# EAGLE design search_controller (EAGLE 9.5.1)
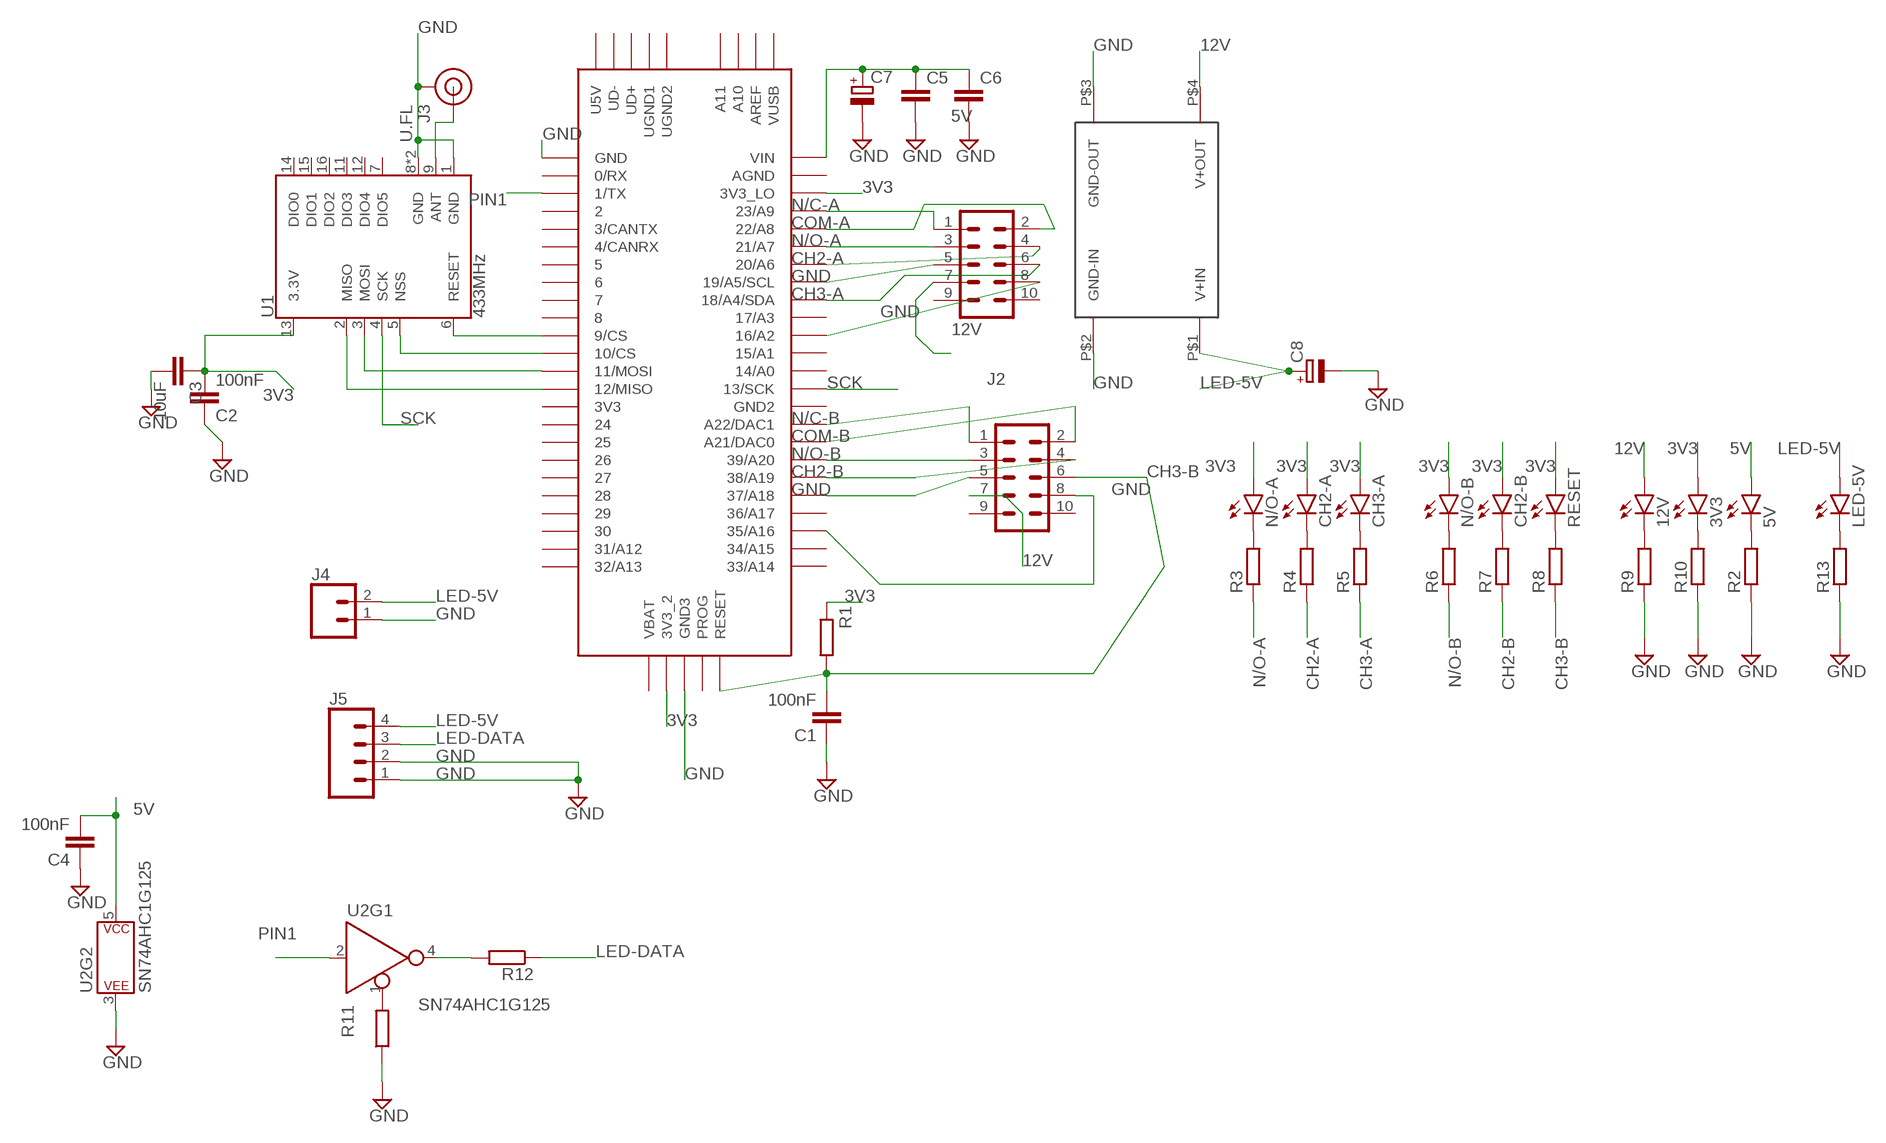
[diagram p0: schematic, sheet 1]

## Parts
3V3  LEDCHIPLED_0805  [CHIPLED_0805]
5V  LEDCHIPLED_0805  [CHIPLED_0805]
12V  LEDCHIPLED_0805  [CHIPLED_0805]
C1  100nF  C-EUC0805  [C0805]
C2  100nF  C-EUC0805  [C0805]
C3  10uF  C-EUC0805  [C0805]
C4  100nF  C-EUC0805  [C0805]
C5  C-EUC0805K  [C0805K]
C6  C-EUC0805K  [C0805K]
C7  CPOL-EUE2,5-6E  [E2,5-6E]
C8  CPOL-EUE5-8.5  [E5-8,5]
CH2-A  LEDCHIPLED_0805  [CHIPLED_0805]
CH2-B  LEDCHIPLED_0805  [CHIPLED_0805]
CH3-A  LEDCHIPLED_0805  [CHIPLED_0805]
J1  CONN_05X2PTH  [2X5]
J2  CONN_05X2PTH  [2X5]
J3  U.FL  U.FL2PIN  [U.FL]
J4  CONN_023.5MM-NO_SILK  [SCREWTERMINAL-3.5MM-2-NS]
J5  CONN_04  [1X04]
LED-5V  LEDCHIPLED_0805  [CHIPLED_0805]
N/O-A  LEDCHIPLED_0805  [CHIPLED_0805]
N/O-B  LEDCHIPLED_0805  [CHIPLED_0805]
R1  R-EU_M0805  [M0805]
R2  R-EU_R0603  [R0603]
R3  R-EU_R0603  [R0603]
R4  R-EU_R0603  [R0603]
R5  R-EU_R0603  [R0603]
R6  R-EU_R0603  [R0603]
R7  R-EU_R0603  [R0603]
R8  R-EU_R0603  [R0603]
R9  R-EU_R0603  [R0603]
R10  R-EU_R0603  [R0603]
R11  R-EU_R0603  [R0603]
R12  R-EU_R0603  [R0603]
R13  R-EU_R0603  [R0603]
RESET  LEDCHIPLED_0805  [CHIPLED_0805]
U1  433MHz  RFM69HCW-433  [RFM69HCW-XXXS2]
U2  SN74AHC1G125  74AHC1G125D  [SOT23-5]
U$1  TEENSY_3.5/3.6  [TEENSY_3.5/3.6]
U$2  BUCK/BOOST  [STANDARDBUCKBOOST]

## Nets
3V3: 3V3.A C2.2 C3.1 CH2-A.A CH2-B.A CH3-A.A N/O-A.A N/O-B.A R1.2 RESET.A U1.13(3.3V) U$1.3V3_2 U$1.3V3_LO
5V: 5V.A C4.2 C5.1 C6.1 C7.+ U2.5(P$V+) U$1.VIN
12V: 12V.A J1.7 J2.7 U$2.P$4(V+OUT)
CH2-A: J1.4 R4.1 U$1.20/A6
CH2-B: J2.4 R7.1 U$1.38/A19
CH3-A: J1.6 R5.1 U$1.18/A4/SDA
CH3-B: C1.2 J2.6 R1.1 R8.1 U$1.RESET
COM-A: J1.2 U$1.22/A8
COM-B: J2.2 U$1.21/DAC0(A21/DAC0)
GND: C1.1 C2.1 C3.2 C4.1 C5.2 C6.2 C7.- C8.- J1.5 J1.8 J2.5 J2.8 J3.1(GND) J3.2(GND) J4.1 J5.1 J5.2 R2.1 R9.1 R10.1 R11.1 R13.1 U1.1(GND) U1.8(GND) U1.10(GND) U2.3(P$V-) U$1.16/A2 U$1.19/A5/SCL U$1.35/A16 U$1.37/A18 U$1.GND U$1.GND3 U$2.P$2(GND-IN) U$2.P$3(GND-OUT)
LED-5V: C8.+ J4.2 J5.4 LED-5V.A U$2.P$1(V+IN)
LED-DATA: J5.3 R12.1
N$1: U1.2(MISO) U$1.12/MISO
N$2: U1.3(MOSI) U$1.11/MOSI
N$3: U1.5(NSS) U$1.10/CS
N$4: J3.FEED(SIGNAL) U1.9(ANT)
N$5: U1.6(RESET) U$1.9/CS
N$6: N/O-A.C R3.2
N$8: CH2-A.C R4.2
N$9: CH3-A.C R5.2
N$10: N/O-B.C R6.2
N$11: CH2-B.C R7.2
N$12: R8.2 RESET.C
N$13: 12V.C R9.2
N$14: 3V3.C R10.2
N$15: R12.2 U2.4(Y)
N$16: LED-5V.C R13.2
N$21: 5V.C R2.2
N$22: R11.2 U2.1(!EN)
N/C-A: J1.1 U$1.23/A9
N/C-B: J2.1 U$1.A22/DAC1
N/O-A: J1.3 R3.1 U$1.21/A7
N/O-B: J2.3 R6.1 U$1.39/A20
PIN1: U2.2(A) U$1.1/TX
SCK: U1.4(SCK) U$1.13/SCK
Unconnected: J1.9 J1.10 J2.9 J2.10 U1.7(DIO5) U1.11(DIO3) U1.12(DIO4) U1.14(DIO0) U1.15(DIO1) U1.16(DIO2) U$1.0/RX U$1.2 U$1.3/CANTX U$1.3V3 U$1.4/CANRX U$1.5 U$1.6 U$1.7 U$1.8 U$1.14/A0 U$1.15/A1 U$1.17/A3 U$1.24 U$1.25 U$1.26 U$1.27 U$1.28 U$1.29 U$1.30 U$1.31/A12 U$1.32/A13 U$1.33/A14 U$1.34/A15 U$1.36/A17 U$1.A10 U$1.A11 U$1.AGND U$1.AREF U$1.GND2 U$1.PROG U$1.U5V U$1.UD+ U$1.UD- U$1.UGND1 U$1.UGND2 U$1.VBAT U$1.VUSB

## Library data of the parts
3V3 5V 12V CH2-A CH2-B CH3-A LED-5V N/O-A N/O-B RESET = led:LED: LED OSRAM: - CHIPLED LG R971, LG N971, LY N971, LG Q971, LY Q971, LO R971, LY R971 LH N974, LH R974 LS Q976, LO Q976, LY Q976 LO Q996 - Hyper CHIPLED LW Q18S LB Q993, LB Q99A, LB R99A - SideLED LS A670, LO A670, LY A670, LG A670, LP A670 LB A673, LV A673, LT A673, LW A673 LH A674 LY A675 LS A676, LA A676, LO A676, LY A676, LW A676 LS A679, LY A679, LG A679 - Hyper Micro SIDELED® LS Y876, LA Y876, LO Y876, LY Y876 LT Y87S - SmartLED LW L88C, LW L88S LB L89C, LB L89S, LG L890 LS L89K, LO L89K, LY L89K LS L896, LA L896, LO L896, LY L896 - TOPLED LS T670, LO T670, LY T670, LG T670, LP T670 LSG T670, LSP T670, LSY T670, LOP T670, LYG T670 LG T671, LOG T671, LSG T671 LB T673, LV T673, LT T673, LW T673 LH T674 LS T676, LA T676, LO T676, LY T676, LB T676, LH T676, LSB T676, LW T676 LB T67C, LV T67C, LT T67C, LS T67K, LO T67K, LY T67K, LW E67C LS E67B, LA E67B, LO E67B, LY E67B, LB E67C, LV E67C, LT E67C LW T67C LS T679, LY T679, LG T679 LS T770, LO T770, LY T770, LG T770, LP T770 LB T773, LV T773, LT T773, LW T773 LH T774 LS E675, LA E675, LY E675, LS T675 LS T776, LA T776, LO T776, LY T776, LB T776 LHGB T686 LT T68C, LB T68C - Hyper Mini TOPLED® LB M676 - Mini TOPLED Santana® LG M470 LS M47K, LO M47K, LY M47K Source: http://www.osram.convergy.de LUXEON: - LUMILED® LXK2-PW12-R00, LXK2-PW12-S00, LXK2-PW14-U00, LXK2-PW14-V00 LXK2-PM12-R00, LXK2-PM12-S00, LXK2-PM14-U00 LXK2-PE12-Q00, LXK2-PE12-R00, LXK2-PE12-S00, LXK2-PE14-T00, LXK2-PE14-U00 LXK2-PB12-K00, LXK2-PB12-L00, LXK2-PB12-M00, LXK2-PB14-N00, LXK2-PB14-P00, LXK2-PB14-Q00 LXK2-PR12-L00, LXK2-PR12-M00, LXK2-PR14-Q00, LXK2-PR14-R00 LXK2-PD12-Q00, LXK2-PD12-R00, LXK2-PD12-S00 LXK2-PH12-R00, LXK2-PH12-S00 LXK2-PL12-P00, LXK2-PL12-Q00, LXK2-PL12-R00 Source: www.luxeon.com KINGBRIGHT: KA-3528ASYC Source: www.kingbright.com
C1-C6 = rcl:C-EU: CAPACITOR, European symbol; SPICEPREFIX: C
C7 C8 = rcl:CPOL-EU: POLARIZED CAPACITOR, European symbol; SPICEPREFIX: C
J1 J2 = SparkFun-Connectors:CONN_05X2: Multi connection point. Often used as Generic Header-pin footprint for 0.1 inch spaced/style header connections For AVR SPI programming port, see special device with nice symbol: "AVR_SPI_PROG_5x2.dev" You can populate with any combo of single row headers, but if you'd like an exact match, check these: 2x5 AVR ICSP Male Header <https://www.sparkfun.com/products/778> (PRT-00778) 2x5 Pin Shrouded Header <https://www.sparkfun.com/products/8506> (PRT-08506) On any of the 0.1 inch spaced packages, you can populate with these: Break Away Headers - Straight <https://www.sparkfun.com/products/116> (PRT-00116) Break Away Male Headers - Right Angle <https://www.sparkfun.com/products/553> (PRT-00553) Female Headers <https://www.sparkfun.com/products/115> (PRT-00115) Break Away Headers - Machine Pin <https://www.sparkfun.com/products/117> (PRT-00117) Break Away Female Headers - Swiss Machine Pin <https://www.sparkfun.com/products/743> (PRT-00743) Special note: the shrouded connector mates well with our 5x2 ribbon cables: 2x5 Pin IDC Ribbon Cable <https://www.sparkfun.com/products/8535> (PRT-08535); PROD_ID: CONN-08499; SF_ID: PRT-0778
J3 = SparkFun-Connectors:U.FL2PIN: SMD Antenna Connector - U.FL 2mm height, 3.0mm x 3.0mm receptacle size. SparkFun Products: SparkFun WiFi Shield - ESP8266 <https://www.sparkfun.com/products/13287> SparkFun ESP8266 Thing <https://www.sparkfun.com/products/13231> SparkFun MiniGen - Pro Mini Signal Generator Shield <https://www.sparkfun.com/products/11420>; PROD_ID: CONN-09193; SF_ID: WRL-09144
J4 = SparkFun-Connectors:CONN_02: Multi connection point. Often used as Generic Header-pin footprint for 0.1 inch spaced/style header connections On any of the 0.1 inch spaced packages, you can populate with these: Break Away Headers - Straight <https://www.sparkfun.com/products/116> (PRT-00116) Break Away Male Headers - Right Angle <https://www.sparkfun.com/products/553> (PRT-00553) Female Headers <https://www.sparkfun.com/products/115> (PRT-00115) Break Away Headers - Machine Pin <https://www.sparkfun.com/products/117> (PRT-00117) Break Away Female Headers - Swiss Machine Pin <https://www.sparkfun.com/products/743> (PRT-00743) For SCREWTERMINALS and SPRING TERMINALS visit here: Screw Terimnals on SparkFun.com <https://www.sparkfun.com/search/results?term=Screw+Terminals> (5mm/3.5mm/2.54mm spacing) This device is also useful as a general connection point to wire up your design to another part of your project. Our various solder wires solder well into these plated through hole pads. Hook-Up Wire - Assortment (Stranded, 22 AWG) <https://www.sparkfun.com/products/11375> (PRT-11375) Hook-Up Wire - Assortment (Solid Core, 22 AWG) <https://www.sparkfun.com/products/11367> (PRT-11367) View the entire wire category on our website here <https://www.sparkfun.com/categories/141> Special notes: Molex polarized connector foot print use with: PRT-08233 with associated crimp pins and housings. 2.54_SCREWTERM for use with PRT-10571. 3.5mm Screw Terminal footprints for PRT-08084 5mm Screw Terminal footprints for use with PRT-08432; PROD_ID: CONN-08399
J5 = SparkFun-Connectors:CONN_04: Multi connection point. Often used as Generic Header-pin footprint for 0.1 inch spaced/style header connections On any of the 0.1 inch spaced packages, you can populate with these: Break Away Headers - Straight <https://www.sparkfun.com/products/116> (PRT-00116) Break Away Male Headers - Right Angle <https://www.sparkfun.com/products/553> (PRT-00553) Female Headers <https://www.sparkfun.com/products/115> (PRT-00115) Break Away Headers - Machine Pin <https://www.sparkfun.com/products/117> (PRT-00117) Break Away Female Headers - Swiss Machine Pin <https://www.sparkfun.com/products/743> (PRT-00743) For SCREWTERMINALS and SPRING TERMINALS visit here: Screw Terimnals on SparkFun.com <https://www.sparkfun.com/search/results?term=Screw+Terminals> (5mm/3.5mm/2.54mm spacing) This device is also useful as a general connection point to wire up your design to another part of your project. Our various solder wires solder well into these plated through hole pads. Hook-Up Wire - Assortment (Stranded, 22 AWG) <https://www.sparkfun.com/products/11375> (PRT-11375) Hook-Up Wire - Assortment (Solid Core, 22 AWG) <https://www.sparkfun.com/products/11367> (PRT-11367) View the entire wire category on our website here <https://www.sparkfun.com/categories/141> Special notes: Molex polarized connector foot print use with SKU : PRT-08231 with associated crimp pins and housings. 1MM SMD Version SKU: PRT-10208; PROD_ID: CONN-09696
R1-R13 = rcl:R-EU_: RESISTOR, European symbol; SPICEPREFIX: R
U1 = SparkFun-RF:RFM69H: Hope RF RFM69H ISM Transceiver Module The RFM69H is a transceiver module capable of operation over a wide frequency range, including the 315,433,868 and 915MHz license-free ISM (Industry Scientific and Medical) frequency bands. All major RF communication parameters are programmable and most of them can be dynamically set. The RFM69H offers the unique advantage of programmable narrow-band and wide- band communication modes. The RFM69H is optimized for low power consumption while offering high RF output power and channelized operation.Compliance ETSI and FCC regulations. Datasheet <http://www.hoperf.cn/upload/docs/RF/SX/RFM69H_DataSheet_v1.3.pdf> SparkFun Products RFM69HCW Wireless Transceiver - 915MHz <https://www.sparkfun.com/products/13909> (COM-13909) RFM69HCW Wireless Transceiver - 434MHz <https://www.sparkfun.com/products/13910> (COM-13910) SparkFun RFM69 Breakout (915MHz) <https://www.sparkfun.com/products/12775> (WRL-12775) SparkFun RFM69 Breakout (434MHz) <https://www.sparkfun.com/products/12823> (WRL-12823); PROD_ID: IC-12053
U2 = SparkFun-IC-Logic:74*1G125: Single buffer Buffers & Line Drivers Tri-State Single Bus SOT-23-5 Datasheet SparkFun Products SparkFun SAMD21 Mini Breakout <https://www.sparkfun.com/products/13664> (DEV-13664) SparkFun SAMD21 Dev Breakout <https://www.sparkfun.com/products/13672> (DEV-13672) SparkFun MIDI Shield <https://www.sparkfun.com/products/12898> (DEV-12898) SparkFun WiFi Shield - CC3000 <https://www.sparkfun.com/products/12071> (DEV-12071); PROD_ID: IC-11920
U$1 = Teensy356:TEENSY_3.5/3.6
U$2 = paul_power:BUCK/BOOST

## Board
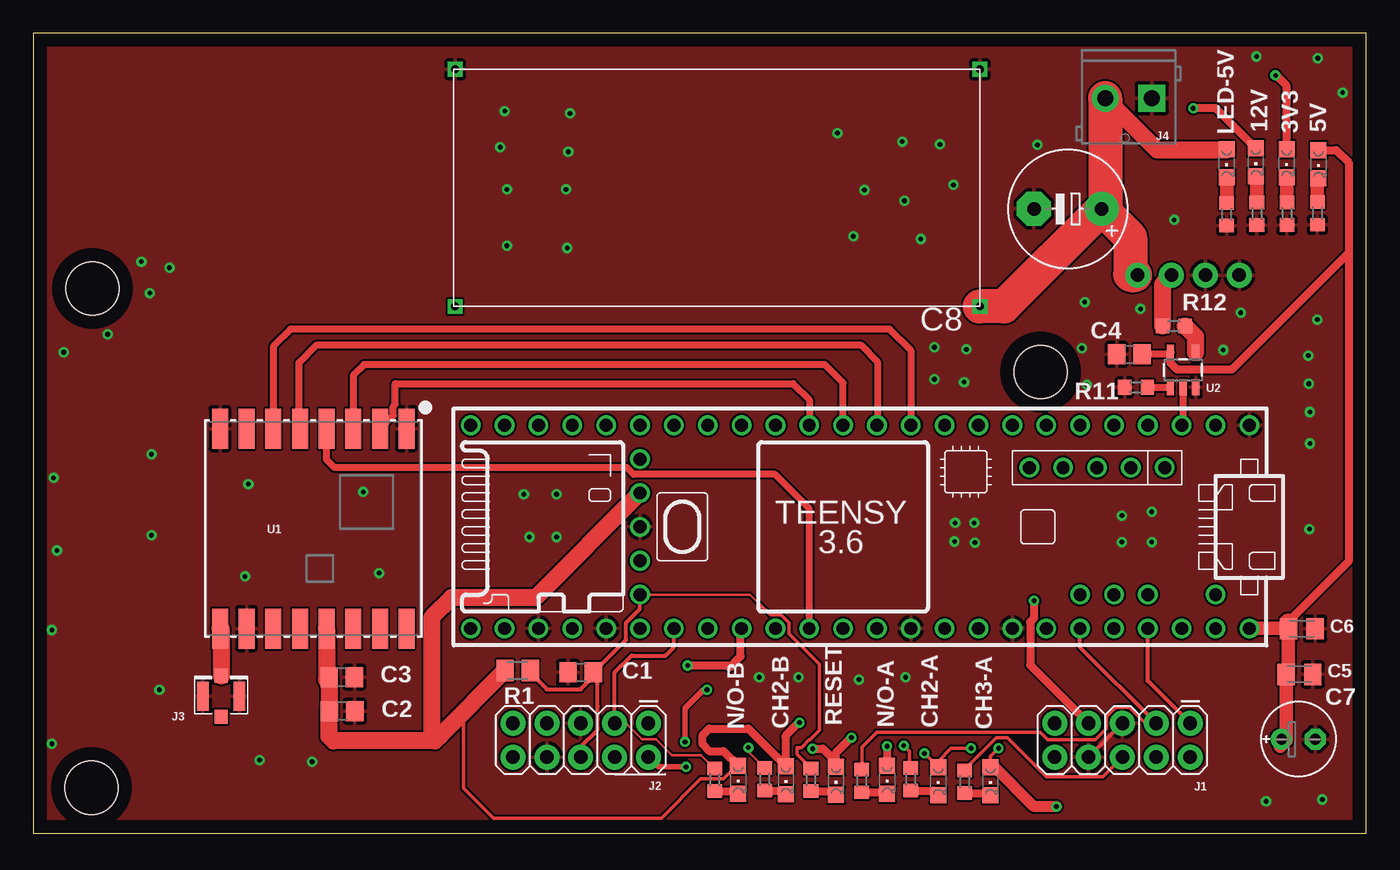
[diagram p1: board, top side]
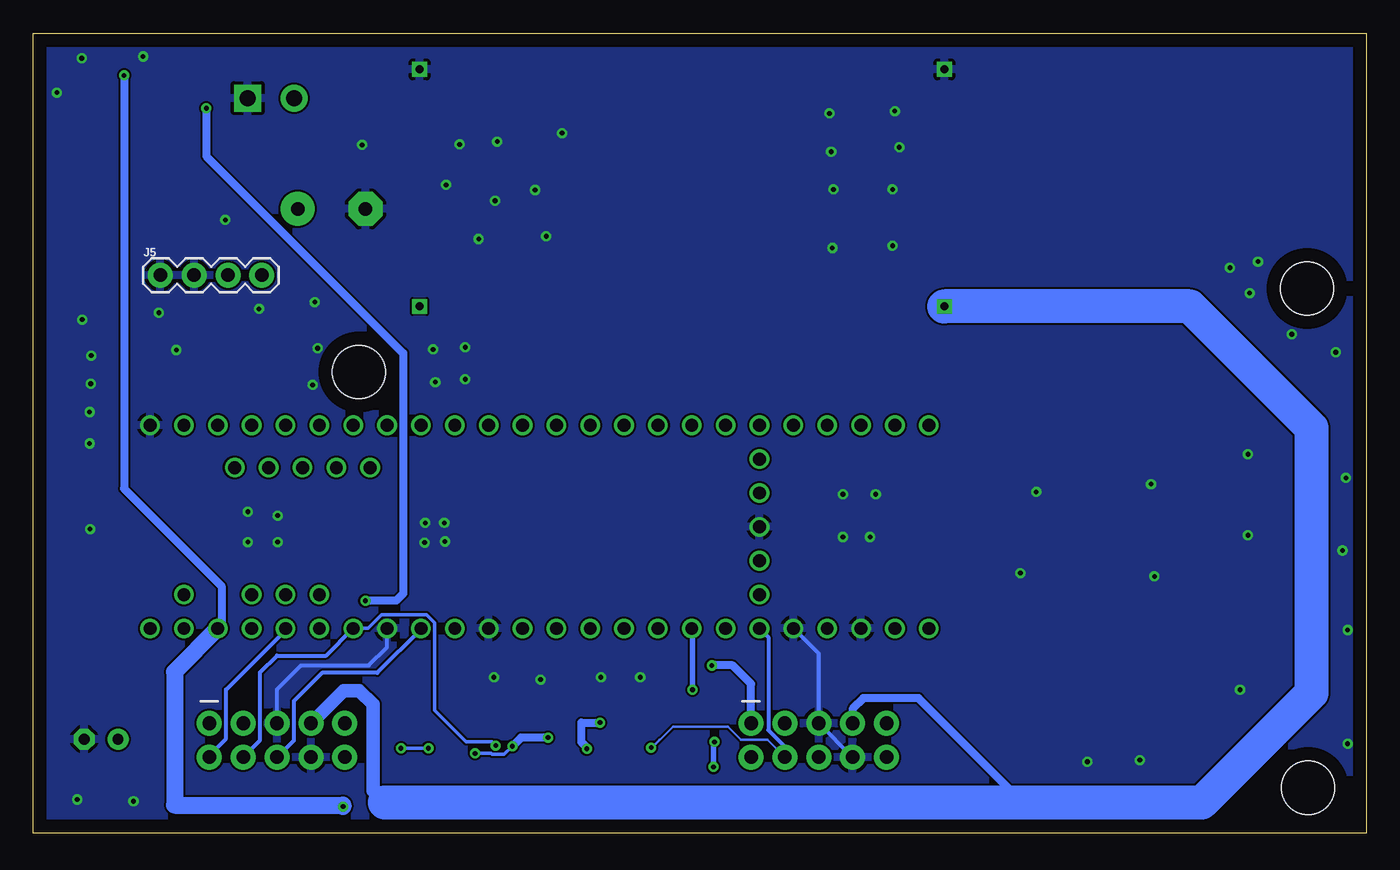
[diagram p2: board, bottom side, seen from below]

Size 100 x 60 mm. Coordinates in mm from the lower left corner, seen from the top.
Outline: 0,0 100,0 100,60 0,60 0,0
Copper layers (1*16): Top 0.035mm / dielectric 1.5mm / Bottom 0.035mm
Design rules "default": minimum track width 6mil, minimum drill 0.35mm, track to track 6mil, track to pad 6mil, pad to pad 6mil, via to via 6mil, smd to smd 6mil, copper to edge 40mil, drill to drill 6mil, minimum pad ring 10mil, minimum via ring 8mil, stop-mask expansion 4mil, vias tented up to drill 0mil, thermal gap 10mil
Holes 4 mm at 4.44,40.86 75.59,34.6 4.35,3.42

### Footprints (pad centres in the part's own frame; a part is rotated, then mirrored left to right if it is on the bottom)
CHIPLED_0805 = smd 1.2 x 1.2: A 0,-1.05; C 0,1.05
C0805 = smd 1.3 x 1.5: 1 -0.95,0; 2 0.95,0
C0805K = smd 1.3 x 1.6: 1 -1,0; 2 1,0
E2,5-6E = drill 0.813 pad 1.575: + -1.27,0 | drill 0.813 pad 1.575 octagon: - 1.27,0
E5-8,5 = drill 1.016 pad 2.54: + -2.54,0 | drill 1.016 pad 2.54 octagon: - 2.54,0
2X5 = drill 1.016 pad 1.88: 1 0,0; 2 0,2.54; 3 2.54,0; 4 2.54,2.54; 5 5.08,0; 6 5.08,2.54; 7 7.62,0; 8 7.62,2.54; 9 10.16,0; 10 10.16,2.54
U.FL = smd 2.2 x 0.85: 1 0,1.375; 2 0,-1.375 | smd 1.05 x 1: FEED 1.525,0; NC -1.525,0
SCREWTERMINAL-3.5MM-2-NS = drill 1.2 pad 2.032 square: 1 0,0 | drill 1.2 pad 2.032: 2 3.5,0
1X04 = drill 1.016 pad 1.88: 1 0,0; 2 2.54,0; 3 5.08,0; 4 7.62,0
M0805 = smd 1.3 x 1.6: 1 -0.95,0; 2 0.95,0
R0603 = smd 1 x 1.1: 1 -0.85,0; 2 0.85,0
RFM69HCW-XXXS2 = smd 3 x 1.2: 1 -7.5,7; 2 -7.5,5; 3 -7.5,3; 4 -7.5,1; 5 -7.5,-1; 6 -7.5,-3; 7 -7.5,-5; 8 -7.5,-7; 9 7.5,-7; 10 7.5,-5; 11 7.5,-3; 12 7.5,-1; 13 7.5,1; 14 7.5,3; 15 7.5,5; 16 7.5,7
SOT23-5 = smd 0.55 x 1.2: 1 -0.95,-1.3; 2 0,-1.3; 3 0.95,-1.3; 4 0.95,1.3; 5 -0.95,1.3
TEENSY_3.5/3.6 = drill 0.965: 0/RX -25.4,-7.62; 1/TX -22.86,-7.62; 2 -20.32,-7.62; 3/CANTX -17.78,-7.62; 3V3 7.62,-7.62; 3V3_2 17.78,-2.54; 3V3_LO -22.86,7.62; 4/CANRX -15.24,-7.62; 5 -12.7,-7.62; 6 -10.16,-7.62; 7 -7.62,-7.62; 8 -5.08,-7.62; 9/CS -2.54,-7.62; 10/CS 0,-7.62; 11/MOSI 2.54,-7.62; 12/MISO 5.08,-7.62; 13/SCK 5.08,7.62; 14/A0 2.54,7.62; 15/A1 0,7.62; 16/A2 -2.54,7.62; 17/A3 -5.08,7.62; 18/A4/SDA -7.62,7.62; 19/A5/SCL -10.16,7.62; 20/A6 -12.7,7.62; 21/A7 -15.24,7.62; 21/DAC0 12.7,7.62; 22/A8 -17.78,7.62; 23/A9 -20.32,7.62; 24 10.16,-7.62; 25 12.7,-7.62; 26 15.24,-7.62; 27 17.78,-7.62; 28 20.32,-7.62; 29 22.86,-7.62; 30 25.4,-7.62; 31/A12 27.94,-7.62; 32/A13 30.48,-7.62; 33/A14 30.48,7.62; 34/A15 27.94,7.62; 35/A16 25.4,7.62; 36/A17 22.86,7.62; 37/A18 20.32,7.62; 38/A19 17.78,7.62; 39/A20 15.24,7.62; A10 -17.78,5.08; A11 -15.24,5.08; A22/DAC1 10.16,7.62; AGND -25.4,7.62; AREF -20.32,5.08; GND -27.94,-7.62; GND2 7.62,7.62; GND3 17.78,0; PROG 17.78,2.54; RESET 17.78,5.08; U5V -21.59,-4.445; UD+ -16.51,-4.445; UD- -19.05,-4.445; UGND1 -13.97,-4.445; UGND2 -11.43,-4.445; VBAT 17.78,-5.08; VIN -27.94,7.62; VUSB -25.4,5.08
STANDARDBUCKBOOST = drill 0.6 square: P$1 -10.16,-20.32; P$2 7.62,-20.32; P$3 7.62,19.05; P$4 -10.16,19.05

### Placement (x,y rotation side)
3V3  94.03,50.27 180 top
5V  96.42,50.19 180 top
12V  91.72,50.32 180 top
C1  41.07,12.06 0 top
C2  23.16,9.17 180 top
C3  23.14,11.71 0 top
C4  82.23,35.92 0 top
C5  95,11.91 0 top
C6  95.17,15.34 0 top
C7  94.92,7.06 0 top
C8  77.62,46.84 180 top
CH2-A  67.89,3.91 180 top
CH2-B  56.46,3.99 180 top
CH3-A  71.81,3.91 180 top
J1  86.79,8.26 180 top
J2  46.15,8.26 180 top
J3  14.1,10.29 90 top
J4  83.92,55.14 180 top
J5  90.47,41.86 0 bottom
LED-5V  89.53,50.24 180 top
N/O-A  64.06,4.01 180 top
N/O-B  52.88,4.01 180 top
R1  36.35,12.22 180 top
R2  96.34,46.5 90 top
R3  62.15,3.94 270 top
R4  65.84,4.05 270 top
R5  69.88,3.87 270 top
R6  51.13,4.03 270 top
R7  54.86,4.05 270 top
R8  58.34,4.03 270 top
R9  91.8,46.47 90 top
R10  94.06,46.47 90 top
R11  82.73,33.45 0 top
R12  85.57,38.05 0 top
R13  89.53,46.43 90 top
RESET  60.22,3.94 180 top
U1  21.01,22.86 270 top
U2  86.26,34.75 0 top
U$1  63.3,22.99 180 top
U$2  50.7,49.68 90 top

### Tracks (layer width: path | path; a pad name or v marks a point on that pad's centre or on a via)
3V3  (via drill 0.35)
  Top 0.254: R1.2 32.28,9.1 32.28,3.38 34.52,1.14 47.12,1.14 50.07,4.1 51.8,4.1 52.63,4.93 53.02,4.93 | v70.36,6.38 68.85,6.38 67.89,5.42 CH2-A.A 66.86,5.99 v66.85,5.99 | v72.42,6.38 72.39,6.38 71.81,5.79 CH3-A.A
  Top 0.61: 3V3.A 94.03,56.06 93.24,56.84 v93.19,56.84 | RESET.A 60.22,5.36 | 60.22,5.36 60.22,6.04 61.37,7.19 v61.38,7.18 | v64.06,6.53 N/O-A.A | v57.48,8.31 57.45,8.33 56.44,7.32 56.44,7.16 56.46,7.14 CH2-B.A 53.66,7.85 50.71,7.85 50.22,7.36 50.22,6.66 50.71,6.17 51.78,6.17 N/O-B.A | v58.47,6.35 59.23,6.35 60.22,5.36 | N/O-B.A | N/O-B.A 53.02,4.93
  Top 0.813: v76.76,2.01 75.08,2.01 72.13,4.96 CH3-A.A
  Top 1.27: U1.13 22.01,11.53 C3.1 22.19,9.2 | 22.19,9.2 C2.2 | R1.2 30.58,7.4 | 30.58,7.4 30.11,6.93 22.53,6.93 22.19,7.28 22.19,9.2 | U$1.3V3_2 37.67,17.68 31.37,17.68 29.9,16.2 29.9,7.54 30.04,7.4 30.58,7.4
  Bottom 0.254: v72.42,6.38 v70.36,6.38 | v66.85,5.99 65.65,5.99 65.58,5.92 64.67,5.92 v64.06,6.53
  Bottom 0.61: v93.19,56.84 93.19,25.86 85.88,18.54 85.88,15.65 U$1.3V3_LO | v61.38,7.18 63.41,7.18 v64.06,6.53 | v58.47,6.35 58.47,6.43 58.9,6.86 58.9,8.28 58.88,8.31 v57.48,8.31
  Bottom 1.27: U$1.3V3_LO 89.41,12.12 89.41,2.11 76.76,2.11 v76.76,2.01
5V
  Top 0.508: U2.5 85.19,35.92 C4.2
  Top 0.61: 5V.A 97.76,51.24 98.68,50.32 98.68,43.54 | 98.68,43.54 98.68,20.4 94.15,15.87 | 98.68,43.54 89.92,34.77 85.83,34.77 85.31,35.29 U2.5
  Top 1.016: U$1.VIN 94.15,15.37 C6.1 94.17,12.09 C5.1 94,6.98 93.55,6.53 93.55,6.96 C7.+
  Top 1.27: 94.15,15.87 94.15,15.37
12V  (via drill 0.35)
  Top 0.61: 12V.A 88.7,54.38 v87.02,54.38 | v75.08,17.45 75.08,16.14 74.8,15.86 74.8,12.62 J1.7
  Bottom 0.61: v87.02,54.38 87.02,50.8 72.24,36.02 72.24,17.98 72.77,17.45 v75.08,17.45 | 12.33,2.3 25.75,2.3 33.59,10.14 37.73,10.14 38.53,9.34 J2.7
  Bottom 1.016: 73.63,2.3 74.52,3.2 74.52,9.68 75.54,10.69 76.73,10.69 J1.7
  Bottom 2.54: 73.63,2.3 73.62,2.3 12.33,2.3 4.09,10.54 4.09,30.39 13.21,39.52 U$2.P$4
CH2-A  (via drill 0.35)
  Top 0.254: v65.3,6.58 65.73,6.15 65.73,5 R4.1
  Bottom 0.254: v65.3,6.58 65.6,6.87 67.53,6.87 69.9,9.25 69.9,15.79 70.5,16.38 73.88,16.38 74.89,15.37 U$1.20/A6
  Bottom 0.305: J1.4 82.98,6.99 82.98,12.06 81.71,13.34 78.03,13.34 U$1.20/A6
CH2-B  (via drill 0.35)
  Top 0.2: R7.1 53.65,6.12 v53.65,6.43
  Bottom 0.2: v53.65,6.43 53.03,7.04 53.65,6.35 51.99,8 47.88,8 46.91,7.04 44.93,7.04 J2.4
  Bottom 0.305: J2.4 43.61,6.5 44.86,7.74 44.86,14.71 U$1.38/A19
CH3-A
  Top 0.254: J1.6 80.26,4.26 76.02,4.26 73.09,7.18 72.26,7.18 69.88,4.8 R5.1
  Bottom 0.305: U$1.18/A4/SDA 70.92,15.32 74.19,12.04 78.34,12.04 80.47,9.91 80.47,6.96 J1.6
CH3-B
  Top 0.2: 54.46,17.22 53.77,17.91 U$1.RESET
  Top 0.254: 54.46,17.22 55.3,16.38 56.1,16.38 56.69,15.79 56.69,14.99 58.98,12.7 58.98,7.72 58.27,7.01 58.2,7.01 57.62,6.43 57.28,6.43 57.28,5.94 R8.1
  Top 0.305: J2.6 41.07,6.5 42.32,7.74 42.32,9.5 42.34,9.53 42.34,11.74 42.18,11.9 | 42.18,11.9 C1.2 44.48,14.52 44.48,15.8 45.52,16.84 U$1.RESET | R1.1 37.3,12.03 38.53,10.79 41.07,10.79 42.18,11.9
COM-A
  Bottom 0.305: J1.2 86.79,5.86 85.55,7.11 85.55,10.77 81.08,15.24 U$1.22/A8
COM-B  (via drill 0.35)
  Top 0.406: J2.2 46.89,4.98 v48.97,4.98 | v48.9,6.86 48.9,9.4 50.27,10.77 v50.55,10.77
  Bottom 0.406: v48.97,4.98 48.97,6.83 48.92,6.88 v48.9,6.86 | v50.55,10.77 50.55,15.32 U$1.21/DAC0
GND  (via drill 0.35)
  Top 0.305: J1.5 J1.8
  Bottom 0.305: J1.5 81.71,10.79 79.91,12.6 74.83,12.6 73.46,13.97 U$1.19/A5/SCL | U$1.37/A18 41.07,13.46 J2.5 J2.8
  other vias: 8.11,42.88 10.22,42.42 8.75,40.52 1.52,26.66 35.53,44.07 35.53,48.29 35.03,51.46 35.36,54.16 40.26,54 40.14,51.12 39.97,48.29 40.05,43.9 95.65,35.83 95.7,33.72 95.78,31.6 95.78,29.24 69.16,23.28 70.6,23.28 70.64,21.8 69.12,21.89 36.8,25.43 39.25,25.43 39.25,22.22 37.22,22.22 25.94,19.52 15.89,19.27 16.14,26.2 24.76,25.6 16.98,5.49 20.91,5.37 54.46,11.7 57.42,11.7 61.94,11.53 65.45,11.7 92.49,2.41 96.71,2.54 95.74,22.82 67.6,36.46 70.01,36.29 69.84,33.84 67.6,34.05 89.27,36.25 79.05,33.63 78.67,36.38 78.88,39.84 83.06,39.33 90.58,39.04 96.33,38.53 66.59,44.57 69.04,48.63 65.19,51.88 62.36,48.25 61.52,44.78 65.36,47.45 68.02,51.67 60.33,52.52 1.77,21.21 1.39,15.25 2.28,36.08 5.58,37.43 1.39,6.72 9.46,10.77 8.87,22.35 8.87,28.43 81.67,23.83 83.91,24.12 83.91,21.84 81.67,21.84 96.37,58.14 91.77,58.26 85.6,46.01 98.23,55.56 75.33,51.63
  pour Top: 100,60 100,0.15 0,0.15 0,59.99
  pour Bottom: 0,0 100,0 100,60 0,60
LED-5V
  Top 0.254: J5.4 82.36,41.86
  Top 1.27: J4.2 84.31,51.26 89.5,51.26 LED-5V.A
  Top 2.54: J4.2 80.42,47.1 C8.+ | C8.+ 72.84,39.52 U$2.P$1 | C8.+ 82.3,44.69 82.3,41.91 82.36,41.86 82.66,41.86
LED-DATA
  Top 1.27: J5.3 84.72,41.18 R12.1
N$1
  Top 0.508: U1.2 27,31.35 27,32.03 27.15,32.18 27.15,33.73 57,33.73 58.22,32.51 U$1.12/MISO
N$2
  Top 0.508: U$1.11/MOSI 60.76,33.78 59.38,35.15 24.82,35.15 24.01,34.34 U1.3
N$3
  Top 0.508: U$1.10/CS 63.32,30.63 63.32,35.38 62.08,36.63 21.26,36.63 19.94,35.31 19.94,30.43 U1.5
N$4
  Top 1.27: U1.9 14.1,15.27 J3.FEED
N$5
  Top 0.508: U$1.9/CS 65.84,36.22 64.24,37.82 19.3,37.82 18.01,36.52 U1.6
N$6
  Top 0.61: R3.2 63.94,3.09 N/O-A.C
N$8
  Top 0.61: R4.2 67.56,3.2 CH2-A.C
N$9
  Top 0.61: R5.2 71.64,3.02 CH3-A.C
N$10
  Top 0.61: R6.2 52.67,3.17 N/O-B.C
N$11
  Top 0.61: R7.2 56.2,3.2 CH2-B.C
N$12
  Top 0.61: R8.2 59.94,3.17 RESET.C
N$13
  Top 1.016: R9.2 91.8,49.19 12V.C
N$14
  Top 1.016: 3V3.C 94.06,49.19 R10.2
N$15
  Top 1.27: U2.4 87.21,37.26 R12.2
N$16
  Top 1.016: R13.2 LED-5V.C
N$21
  Top 1.016: 5V.C 96.34,49.06 R2.2
N$22
  Top 0.508: R11.2 U2.1
N/C-A
  Top 0.305: J1.1 83.62,11.43 U$1.23/A9
N/C-B  (via drill 0.35)
  Top 0.152: 53.06,15.29 U$1.A22/DAC1
  Top 0.61: v49.09,12.59 52.05,12.59 52.22,12.42 53.06,13.27 53.06,15.29
  Bottom 0.61: J2.1 46.15,11.21 47.53,12.59 v49.09,12.59
N/O-A
  Top 0.254: R3.1 62.15,6.46 63.28,7.59 75.57,7.59 76.13,7.04 79.68,7.04 80.49,7.85 80.49,8.76 81.21,9.47 82.22,9.47 83.44,8.26 J1.3
  Top 0.305: J1.3 78.54,13.97 U$1.21/A7
N/O-B
  Top 0.2: J2.3 44.47,8.26 45.66,7.06 46.73,7.06 47.93,5.87 50.09,5.87 51.26,4.7 51.26,4.85 51.13,4.98 51.13,4.95 50.95,4.95 50.93,4.98 51,4.98 51.03,4.95 51.03,4.88 51.21,4.7
  Top 0.305: J2.3 43.61,12.06 44.88,13.34 47.42,13.34 48.06,13.97 U$1.39/A20
  Top 0.406: R6.1 51.13,4.83 51.26,4.7
  Top 0.61: R6.1 51.13,4.78 51.21,4.7
PIN1
  Top 0.508: U2.2 86.26,30.71 U$1.1/TX
SCK
  Top 0.508: U$1.13/SCK 58.22,24.33 55.63,26.92 45.04,26.92 44.53,27.43 22.61,27.43 22.01,28.03 U1.4

### Text on the board
tStop: /home/aati/Downloads/searchfinak.bmp